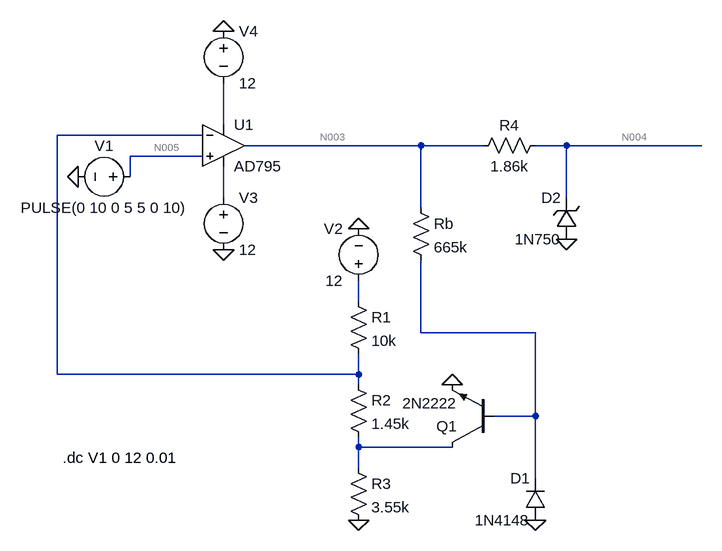
[diagram p0: schematic task33.asc]
task33.asc, the LTspice schematic file:
Version 4.1
SHEET 1 916 740
WIRE 176 112 176 48
WIRE 144 128 -80 128
WIRE 480 144 208 144
WIRE 576 144 480 144
WIRE 704 144 656 144
WIRE 912 144 704 144
WIRE 144 160 32 160
WIRE 32 192 32 160
WIRE 176 224 176 176
WIRE 704 224 704 144
WIRE 480 240 480 144
WIRE 384 384 384 352
WIRE 480 432 480 320
WIRE 656 432 480 432
WIRE -80 496 -80 128
WIRE 384 496 384 464
WIRE 384 496 -80 496
WIRE 384 512 384 496
WIRE 656 560 656 432
WIRE 656 560 592 560
WIRE 384 608 384 592
WIRE 528 608 384 608
WIRE 384 640 384 608
WIRE 656 656 656 560
FLAG 384 720 0
FLAG 528 512 0
FLAG 704 288 0
FLAG 656 720 0
FLAG -48 192 0
FLAG 176 304 0
FLAG 176 -32 0
FLAG 384 272 0
SYMBOL res 368 368 R0
SYMATTR InstName R1
SYMATTR Value 10k
SYMBOL res 368 496 R0
SYMATTR InstName R2
SYMATTR Value 1.45k
SYMBOL res 368 624 R0
SYMATTR InstName R3
SYMATTR Value 3.55k
SYMBOL res 672 128 R90
WINDOW 0 0 56 VBottom 2
WINDOW 3 32 56 VTop 2
SYMATTR InstName R4
SYMATTR Value 1.86k
SYMBOL npn 592 608 R180
SYMATTR InstName Q1
SYMATTR Value 2N2222
SYMBOL res 464 224 R0
SYMATTR InstName Rb
SYMATTR Value 665k
SYMBOL diode 672 720 R180
WINDOW 0 24 64 Left 2
WINDOW 3 24 0 Left 2
SYMATTR InstName D1
SYMATTR Value 1N4148
SYMBOL zener 720 288 R180
WINDOW 0 24 64 Left 2
WINDOW 3 24 0 Left 2
SYMATTR InstName D2
SYMATTR Value 1N750
SYMBOL OpAmps\\AD795 176 80 R0
SYMATTR InstName U1
SYMBOL voltage 48 192 R90
WINDOW 0 -32 56 VBottom 2
WINDOW 3 32 56 VTop 2
SYMATTR InstName V1
SYMATTR Value PULSE(0 10 0 5 5 0 10)
SYMBOL voltage 384 368 R180
WINDOW 0 24 96 Left 2
WINDOW 3 24 16 Left 2
SYMATTR InstName V2
SYMATTR Value 12
SYMBOL voltage 176 208 R0
SYMATTR InstName V3
SYMATTR Value 12
SYMBOL voltage 176 -48 R0
SYMATTR InstName V4
SYMATTR Value 12
TEXT -72 624 Left 2 !.dc V1 0 12 0.01

The netlist it stands for:
* task33.asc
R1 N007 N002 10k
R2 N002 N009 1.45k
R3 N009 0 3.55k
R4 N004 N003 1.86k
Q1 N009 N008 0 0 2N2222
Rb N003 N008 665k
D1 0 N008 1N4148
D2 0 N004 1N750
X§U1 N005 N002 N001 N006 N003 AD795  ; pins In+ In- V+ V- OUT
V1 N005 0 PULSE(0 10 0 5 5 0 10)
V2 N007 0 12
V3 N006 0 12
V4 0 N001 12
.model D D
.lib standard.dio
.model NPN NPN
.model PNP PNP
.lib standard.bjt
.dc V1 0 12 0.01
.lib ADI1.lib
.backanno
.end

* Results of the author's LTspice run, read from the files saved beside the schematic
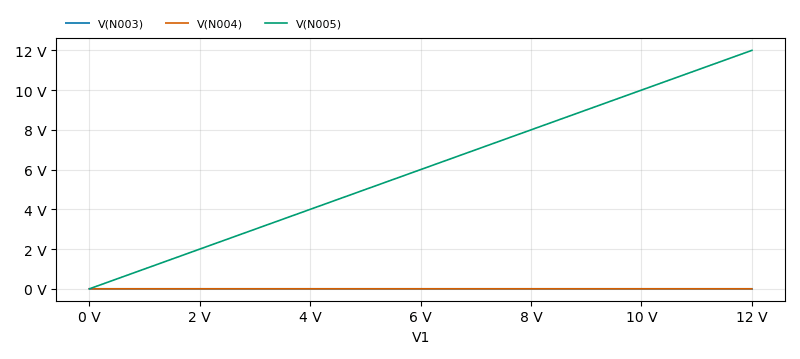
[diagram p1: DC transfer characteristic of task33.asc, plotted from the saved traces]
* DC transfer characteristic, 1 run:
*   V(N003): 8.64e-05 fV at V1=0 V, -0.0001728 fV at V1=12 V, min -0.0001728 fV, max 8.64e-05 fV
*   V(N004): 8.641e-05 fV at V1=0 V, -0.0001728 fV at V1=12 V, min -0.0001728 fV, max 8.641e-05 fV
*   V(N005): 0 V at V1=0 V, 12 V at V1=12 V, min 0 V, max 12 V